# Altium schematic sheet 01_Invertor.SchDoc
size A4; Organization: OLTEST; Revision: 01; SheetNumber: 1; SheetTotal: 2; Разработчик: Бондарчук С.; Прибор: R100; АМАК.000000.000 Э3: R100.230.010.000-00; Дата: 05.04.2019; Формат: A4; PageSetup: Record=PageOptions|CenterHorizontal=True|CenterVertical=True|PrintScale=0.97|XCorrection=1.00|YCorrection=1.00|PrintKind=0|BorderSize=5000000|LeftOffset=0|BottomOffset=0|Orientation=2|PaperLength=2970|PaperWidth=2100|Scale=100|PaperSource=7|PrintQuality=-3|MediaType=1|DitherType=10|PrintScaleMode=1|PaperKind=A4|PaperIndex=9; WorkspaceName: R100_Boards_v1
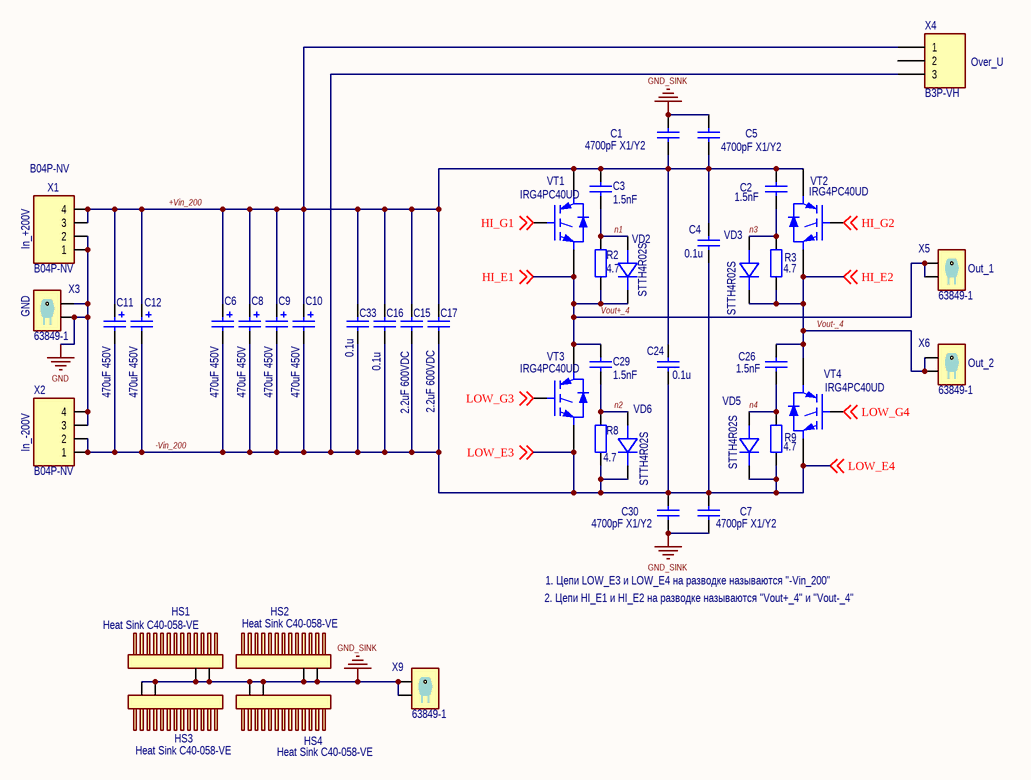
[diagram p0: 01_Invertor.SchDoc]

## Parts
C1  4700pF X1/Y2  [SMD_C_2220]
C2  1.5nF  [SMD_C_1808]
C3  1.5nF  [SMD_C_1808]
C4  0.1u  [SMD_C_1812]
C5  4700pF X1/Y2  [SMD_C_2220]
C6  470uF 450V  [El_D35_H45_LS10]
C7  4700pF X1/Y2  [SMD_C_2220]
C8  470uF 450V  [El_D35_H45_LS10]
C9  470uF 450V  [El_D35_H45_LS10]
C10  470uF 450V  [El_D35_H45_LS10]
C11  470uF 450V  [El_D35_H45_LS10]
C12  470uF 450V  [El_D35_H45_LS10]
C15  2.2uF 600VDC  [MKP_W20_H39.5_L41.5_LS37.5]
C16  0.1u  [SMD_C_1812]
C17  2.2uF 600VDC  [MKP_W20_H39.5_L41.5_LS37.5]
C24  0.1u  [SMD_C_1812]
C26  1.5nF  [SMD_C_1808]
C29  1.5nF  [SMD_C_1808]
C30  4700pF X1/Y2  [SMD_C_2220]
C33  0.1u  [SMD_C_1812]
HS1  Heat Sink C40-058-VE  [Heat Sink C40-058-VE]
HS2  Heat Sink C40-058-VE  [Heat Sink C40-058-VE]
HS3  Heat Sink C40-058-VE  [Heat Sink C40-058-VE]
HS4  Heat Sink C40-058-VE  [Heat Sink C40-058-VE]
R2  4.7  [SMD_R_2512]
R3  4.7  [SMD_R_2512]
R8  4.7  [SMD_R_2512]
R9  4.7  [SMD_R_2512]
VD2  STTH4R02S  [SMC]
VD3  STTH4R02S  [SMC]
VD5  STTH4R02S  [SMC]
VD6  STTH4R02S  [SMC]
VT1  IRG4PC40UD  [TO-247AC-3Pins]
VT2  IRG4PC40UD  [TO-247AC-3Pins]
VT3  IRG4PC40UD  [TO-247AC-3Pins]
VT4  IRG4PC40UD  [TO-247AC-3Pins]
X1  B04P-NV  [B04P-NV]
X2  B04P-NV  [B04P-NV]
X3  63849-1  [63849-1+insulator(154719-1)]
X4  B3P-VH  [B3P-VH]
X5  63849-1  [63849-1+insulator(154719-1)]
X6  63849-1  [63849-1+insulator(154719-1)]
X9  63849-1  [63849-1+insulator(154719-1)]

## Nets
GND: X1.1 X1.2 X2.3 X2.4 X3.1 X3.2
GND_SINK: C1.2 C5.2 C7.1 C30.2 HS1.1 HS1.2 HS2.1 HS2.2 HS3.1 HS3.2 HS4.1 HS4.2 X9.1 X9.2
+Vin_200: C1.1 C2.2 C3.2 C4.2 C5.1 C6.1 C8.1 C9.1 C10.1 C11.1 C12.1 C15.1 C16.2 C17.1 C24.2 C33.2 VT1.2(C) VT2.2(C) X1.3 X1.4 X4.1
-Vin_200: C4.1 C6.2 C7.2 C8.2 C9.2 C10.2 C11.2 C12.2 C15.2 C16.1 C17.2 C24.1 C30.1 C33.1 R8.1 R9.1 VD5.2(CATHODE) VD6.2(CATHODE) VT3.3(E) VT4.3(E) X2.1 X2.2 X4.3 ; off-sheet LOW_E3, off-sheet LOW_E4  [also labelled LOW_E3, LOW_E4]
HI_G1: VT1.1(G) ; off-sheet HI_G1
HI_G2: VT2.1(G) ; off-sheet HI_G2
LOW_G3: VT3.1(G) ; off-sheet LOW_G3
LOW_G4: VT4.1(G) ; off-sheet LOW_G4
n1: C3.1 R2.2 VD2.1(ANODE)
n2: C29.1 R8.2 VD6.1(ANODE)
n3: C2.1 R3.2 VD3.1(ANODE)
n4: C26.1 R9.2 VD5.1(ANODE)
Vout+_4: C29.2 R2.1 VD2.2(CATHODE) VT1.3(E) VT3.2(C) X5.1 X5.2 ; off-sheet HI_E1  [also labelled HI_E1]
Vout-_4: C26.2 R3.1 VD3.2(CATHODE) VT2.3(E) VT4.2(C) X6.1 X6.2 ; off-sheet HI_E2  [also labelled HI_E2]

Not connected (* = marked no-connect by the designer): X4 2

## Notes on the sheet
- (near X4) Over_U
- In_+200V
- (near X5) Out_1
- (near X3) GND
- (near X6) Out_2
- (near X2) In_-200V
- 2. Цепи HI_E1 и HI_E2 на разводке называются "Vout+_4" и "Vout-_4"
- 1. Цепи LOW_E3 и LOW_E4 на разводке называются "-Vin_200"
- Разработчик:
- Формат:
- Rev.:
- Лист
- Дата:
- Листов
- WorkSpace:
- Дата изм.:

## Library data of the parts
C1 C5 C7 C30 = C X1Y2 4700pF SMD 2220 250Vac 10%: SMD C2220 MURATA 250Vac 10% X7R X1Y2; PartNumber: GA355DR7GF472kW01; Manufacturer: MURATA; Value: 4700pF X1/Y2
C2 C3 C26 C29 = C1808 1.5nF 2KV 10%: SMD C 1808 AVX 2kV 10%  X7R; PartNumber: 1808GC152KAT; Manufacturer: AVX; Value: 1.5nF
C4 C16 C24 C33 = C1812 0.1u 630V 10%: SMD C 1812 MURATA 630V 10% X7R; PartNumber: GRM43DR72J104K; Manufacturer: MURATA; Value: 0.1u
C6 C8-C12 = FC 470uF 20% 450V: Aluminum Electrolytic Radial D35 H45 LS10 450V 20%; PartNumber: LG450M0470BPF-3545; Manufacturer: YAGEO; Value: 470uF 450V
C15 C17 = MKP1 2.2uF 10% 600VDC: Polypropelene W20 H39.5 L41.5 LS37.5 600VDC 10%; PartNumber: MKP1J042207G00K; Manufacturer: Wima; Value: 2.2uF 600VDC
HS1-HS4 = Heat Sink C40-058-VE: Heat Sink; Manufacturer: OLTEST; PartNumber: C40-058-VE
R2 R3 R8 R9 = R2512 4.7 1%: SMD R 2512 VISHAY 1W 500V 1% 100ppm; PartNumber: CRCW25124R70FK; Manufacturer: VISHAY; Value: 4.7
VD2 VD3 VD5 VD6 = STTH4R02S: If=4A, Vf=0.76V Vrrm=200V Diode (SMC); Manufacturer: STMicroelectronics; PartNumber: STTH4R02S
VT1-VT4 = IRG4PC40UD: Insulated Gate Bipolar Transistor with Ultrafast Soft Recovery Diode; Manufacturer: International Rectifier; PartNumber: IRG4PC40UDPbF
X1 X2 = B04P-NV: NV 4 конт LS=5.0 10A 250V PCB; Manufacturer: JST; PartNumber: B04P-NV
X3 X5 X6 X9 = 63849-1: PCB, 6.3х0.8, hole; Manufacturer: TE Connectivity; PartNumber: 63849-1
X4 = B3P-VH: VH Top, 10A 250V 3.96mm; Manufacturer: JST; PartNumber: B3P-VH